# Altium schematic sheet 四足机器人原理图.SchDoc
size A4
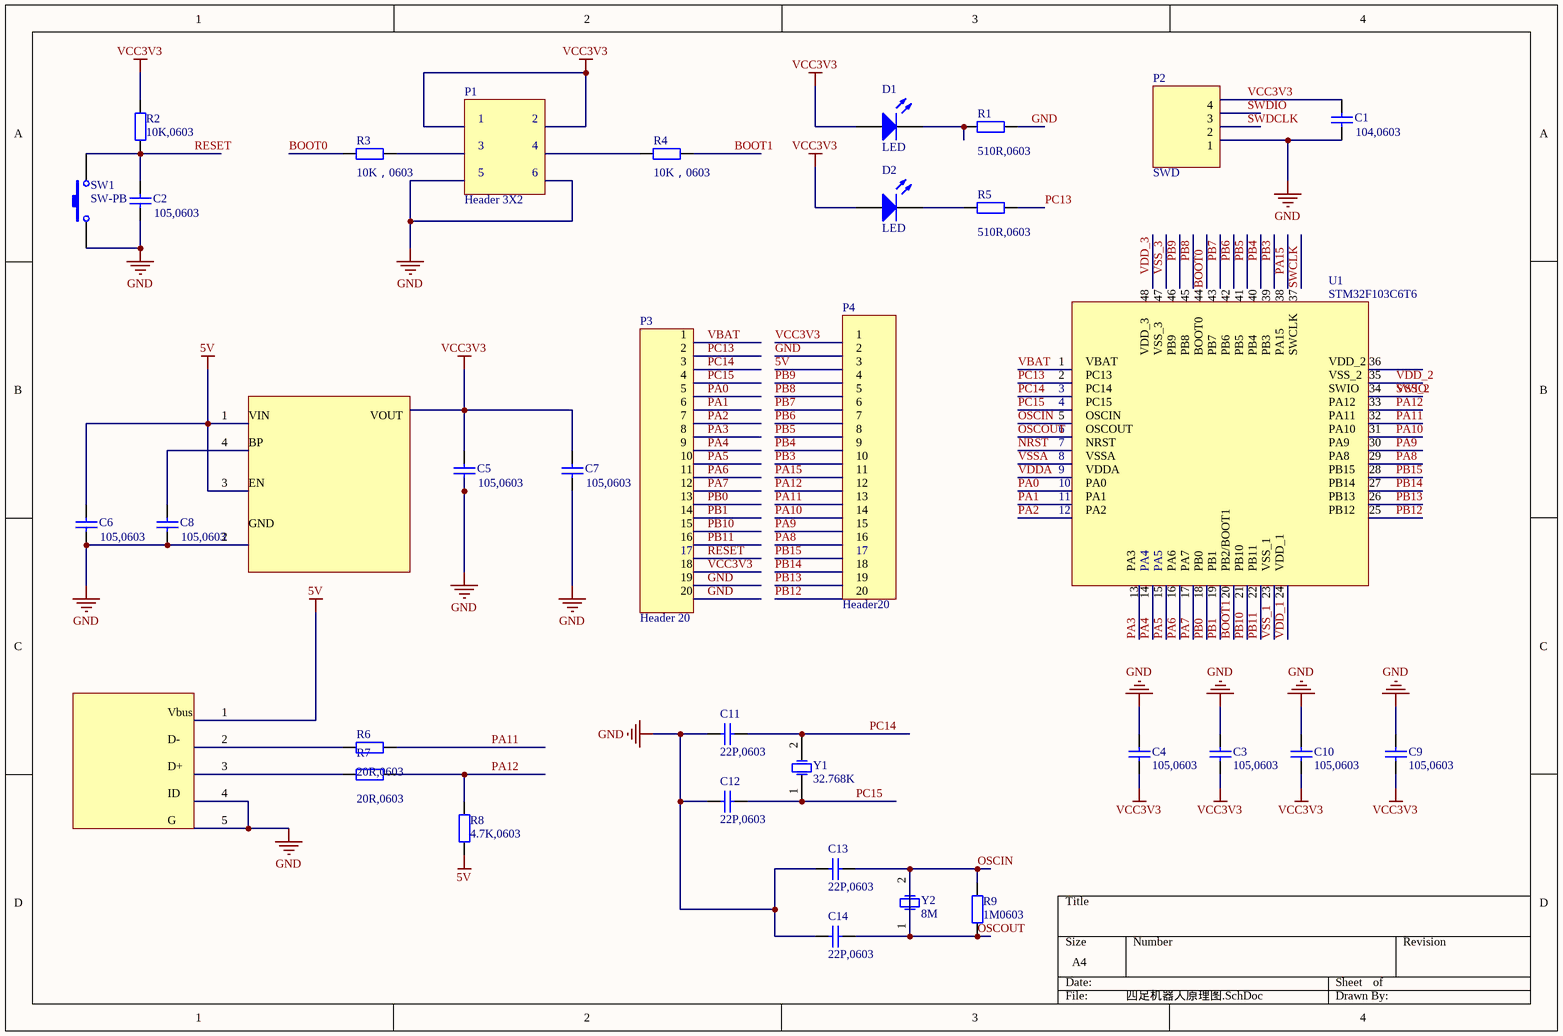
[diagram p0: 四足机器人原理图.SchDoc]

## Parts
C1  value 104,0603  [RAD-0.3]  (hidden comment: Cap)
C2  value 105,0603  [RAD-0.3]  (hidden comment: Cap)
C3  value 105,0603  [RAD-0.3]  (hidden comment: Cap)
C4  value 105,0603  [RAD-0.3]  (hidden comment: Cap)
C5  value 105,0603  [RAD-0.3]  (hidden comment: Cap)
C6  value 105,0603  [RAD-0.3]  (hidden comment: Cap)
C7  value 105,0603  [RAD-0.3]  (hidden comment: Cap)
C8  value 105,0603  [RAD-0.3]  (hidden comment: Cap)
C9  value 105,0603  [RAD-0.3]  (hidden comment: Cap)
C10  value 105,0603  [RAD-0.3]  (hidden comment: Cap)
C11  value 22P,0603  [RAD-0.3]  (hidden comment: Cap)
C12  value 22P,0603  [RAD-0.3]  (hidden comment: Cap)
C13  value 22P,0603  [RAD-0.3]  (hidden comment: Cap)
C14  value 22P,0603  [RAD-0.3]  (hidden comment: Cap)
D1  LED  [LED-0]
D2  LED  [LED-0]
R1  value 510R,0603  [AXIAL-0.4]  (hidden comment: Res2)
R2  value 10K,0603  [AXIAL-0.4]  (hidden comment: Res2)
R3  value 10K，0603  [AXIAL-0.4]  (hidden comment: Res2)
R4  value 10K，0603  [AXIAL-0.4]  (hidden comment: Res2)
R5  value 510R,0603  [AXIAL-0.4]  (hidden comment: Res2)
R6  value 20R,0603  [AXIAL-0.4]  (hidden comment: Res2)
R7  value 20R,0603  [AXIAL-0.4]  (hidden comment: Res2)
R8  value 4.7K,0603  [AXIAL-0.4]  (hidden comment: Res2)
R9  value 1M0603  [AXIAL-0.4]  (hidden comment: Res2)
SW1  SW-PB  [SPST-2]
Y1  32.768K  [R38]
Y2  8M  [R38]

## Nets
5V: C6.2 R8.1
GND: C1.1 C2.1 C3.1 C4.1 C5.1 C6.1 C7.1 C8.1 C9.1 C10.1 C11.2 C12.2 C13.2 C14.2 SW1.1
VCC3V3: C3.2 C4.2 C5.2 C7.2 C9.2 C10.2 D1.1(A) D2.1(A) R2.2
OSCIN: C13.1 C14.1 R9.1 R9.2 Y2.1(OSC1) Y2.2(OSC2)  [also labelled OSCOUT]
PA11: R6.2
PA12: R7.2 R8.2
PC14: C11.1 Y1.2(OSC2)
PC15: C12.1 Y1.1(OSC1)
NetC2_2: C2.2 R2.1 SW1.2
NetD1_2: D1.2(K) R1.1
NetD2_2: D2.2(K) R5.1

Not connected (* = marked no-connect by the designer): C1 2; C8 2; R1 2; R3 1 2; R4 1 2; R5 2; R6 1; R7 1

## Notes on the sheet
- P1
- P2
- 4
- VCC3V3
- SWDIO
- RESET
- (near R3) BOOT0
- 1
- 5
- 3
- 2
- 6
- BOOT1
- (near R1) GND
- SWD
- SWDCLK
- Header 3X2
- (near R5) PC13
- P4
- 48
- VDD_3
- 47
- VSS_3
- 46
- PB9
- 45
- PB8
- 44
- BOOT0
- 43
- PB7
- 42
- PB6
- 41
- PB5
- 40
- PB4
- 39
- PB3
- 38
- PA15
- 37
- SWCLK
- U1
- STM32F103C6T6
- P3
- GND
- 5V
- VBAT
- PC13
- VDD_2
- VSS_2
- 35
- 36
- VIN
- BP
- VOUT
- 7
- 9
- 8
- PC15
- OSCOUT
- NRST
- OSCIN
- PC14
- SWIO
- PA12
- PA11
- PA10
- PA9
- 34
- 33
- 32
- 31
- 30
- EN
- 10
- 12
- 13
- 14
- 11
- VSSA
- PA0
- PA2
- PA1
- VDDA
- PA8
- PB15
- PB14
- PB13
- PB12
- 29
- 28
- 27
- 26
- 25
- 15
- 16
- 18
- 17
- 19
- PA3
- PA4
- PA5
- PA6
- PA7
- PB0
- PB1
- PB2/BOOT1
- PB10
- PB11
- VSS_1
- VDD_1
- Header 20
- 20
- Header20
- 21
- 22
- 23
- 24
- Vbus
- D-
- D+
- ID
- G

## Library data of the parts
C1-C14 = Cap: Capacitor; Published: 8-Jun-2000; LatestRevisionDate: 17-Jul-2002; LatestRevisionNote: Re-released for DXP Platform.; PackageReference: RAD-0.3; Publisher: Altium Limited; PackageDescription: Radial Cap, Thru-Hole; 2 Leads; 0.3 in Pin Spacing
D1 D2 = LED0: Typical INFRARED GaAs LED; Published: 8-Jun-2000; LatestRevisionDate: 08-Jul-2005; LatestRevisionNote: Mech Layer 1 removed.; PackageReference: LED-0; Publisher: Altium Limited; PackageDescription: LED; 2 Leads
R1-R9 = Res2: Resistor; Published: 8-Jun-2000; LatestRevisionDate: 17-Jul-2002; LatestRevisionNote: Re-released for DXP Platform.; PackageReference: AXIAL-0.4; Publisher: Altium Limited; PackageDescription: Axial Device, Thru-Hole; 2 Leads; 0.4 in Pin Spacing
SW1 = SW-PB: Switch; Published: 24-Mar-1999; LatestRevisionDate: 17-Jul-2002; LatestRevisionNote: Re-released for DXP Platform.; PackageReference: SPST-2; Publisher: Altium Limited; PackageDescription: Switch; 2 Leads
Y1 Y2 = XTAL: Crystal Oscillator; Published: 8-Jun-2000; LatestRevisionDate: 17-Jul-2002; LatestRevisionNote: Re-released for DXP Platform.; PackageReference: R38; Publisher: Altium Limited; PackageDescription: Crystal, Thru-Hole; 2 Leads; Body 3.1 x 8.2 mm (Dia.xH)